# Altium project CSB540otn.PrjPcb (part 2 of 2)

## Sheet cpu_pwr.SchDoc: CPU Power and Bypass
size B; Engineer: Michael J. Kelly; Organization: CSB540otn - Outernet; Address1: AM335x Compute Board; Address2: (C) 2015; Address3: See us on the Web:; Address4: http://outernet.is; DocumentNumber: 8; Revision: V1.0; SheetNumber: 8; SheetTotal: 9
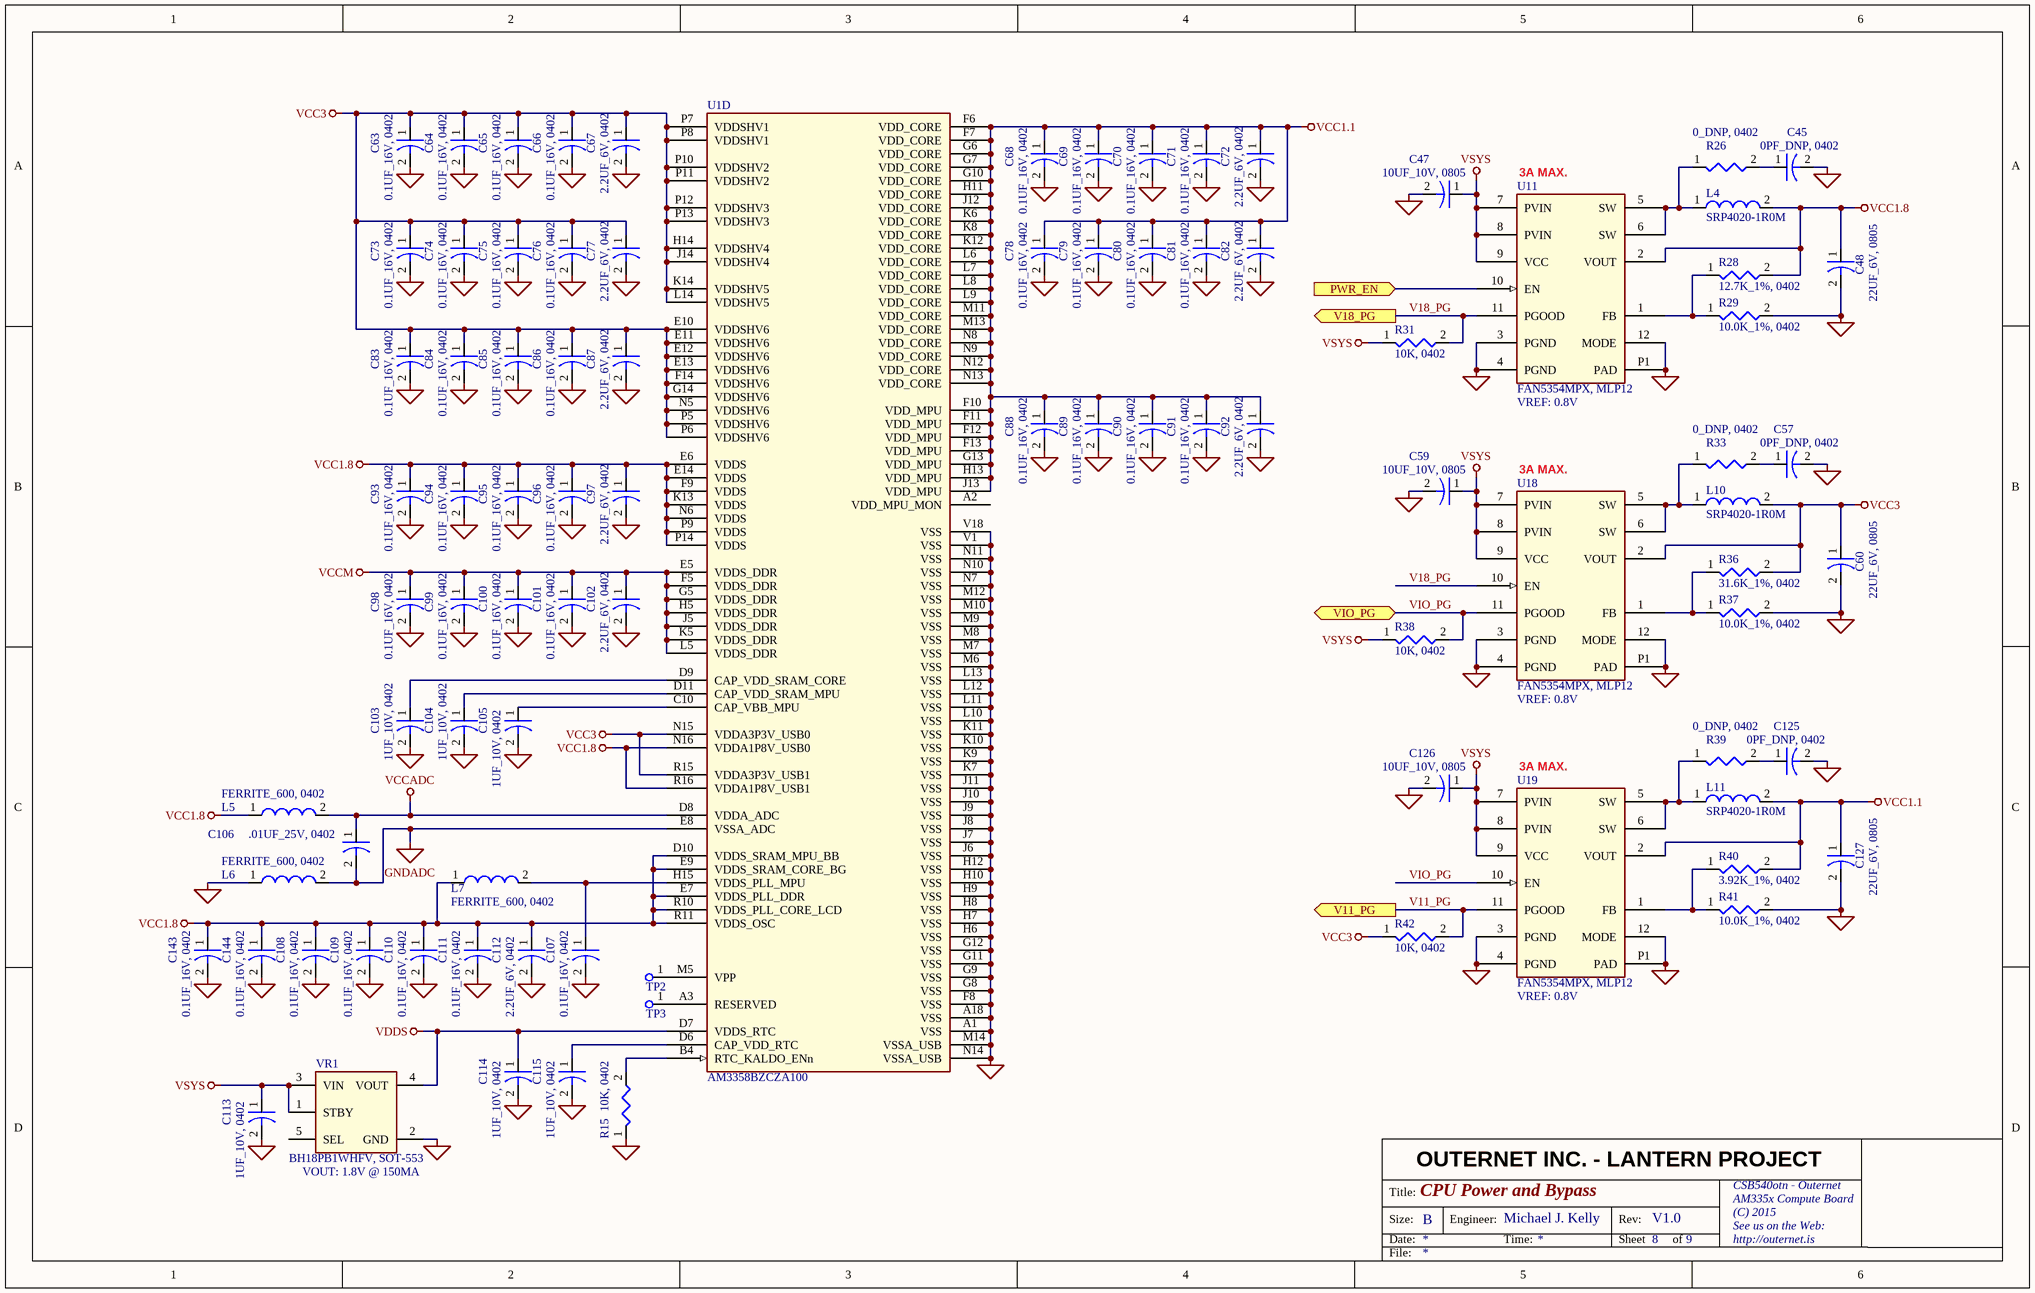
[diagram p6: cpu_pwr.SchDoc]

### Parts
C45  0PF_DNP, 0402  [0402C]
C47  10UF_10V, 0805  [0805C]
C48  22UF_6V, 0805  [0805C]
C57  0PF_DNP, 0402  [0402C]
C59  10UF_10V, 0805  [0805C]
C60  22UF_6V, 0805  [0805C]
C63  0.1UF_16V, 0402  [0402C]
C64  0.1UF_16V, 0402  [0402C]
C65  0.1UF_16V, 0402  [0402C]
C66  0.1UF_16V, 0402  [0402C]
C67  2.2UF_6V, 0402  [0402C]
C68  0.1UF_16V, 0402  [0402C]
C69  0.1UF_16V, 0402  [0402C]
C70  0.1UF_16V, 0402  [0402C]
C71  0.1UF_16V, 0402  [0402C]
C72  2.2UF_6V, 0402  [0402C]
C73  0.1UF_16V, 0402  [0402C]
C74  0.1UF_16V, 0402  [0402C]
C75  0.1UF_16V, 0402  [0402C]
C76  0.1UF_16V, 0402  [0402C]
C77  2.2UF_6V, 0402  [0402C]
C78  0.1UF_16V, 0402  [0402C]
C79  0.1UF_16V, 0402  [0402C]
C80  0.1UF_16V, 0402  [0402C]
C81  0.1UF_16V, 0402  [0402C]
C82  2.2UF_6V, 0402  [0402C]
C83  0.1UF_16V, 0402  [0402C]
C84  0.1UF_16V, 0402  [0402C]
C85  0.1UF_16V, 0402  [0402C]
C86  0.1UF_16V, 0402  [0402C]
C87  2.2UF_6V, 0402  [0402C]
C88  0.1UF_16V, 0402  [0402C]
C89  0.1UF_16V, 0402  [0402C]
C90  0.1UF_16V, 0402  [0402C]
C91  0.1UF_16V, 0402  [0402C]
C92  2.2UF_6V, 0402  [0402C]
C93  0.1UF_16V, 0402  [0402C]
C94  0.1UF_16V, 0402  [0402C]
C95  0.1UF_16V, 0402  [0402C]
C96  0.1UF_16V, 0402  [0402C]
C97  2.2UF_6V, 0402  [0402C]
C98  0.1UF_16V, 0402  [0402C]
C99  0.1UF_16V, 0402  [0402C]
C100  0.1UF_16V, 0402  [0402C]
C101  0.1UF_16V, 0402  [0402C]
C102  2.2UF_6V, 0402  [0402C]
C103  1UF_10V, 0402  [0402C]
C104  1UF_10V, 0402  [0402C]
C105  1UF_10V, 0402  [0402C]
C106  .01UF_25V, 0402  [0402C]
C107  0.1UF_16V, 0402  [0402C]
C108  0.1UF_16V, 0402  [0402C]
C109  0.1UF_16V, 0402  [0402C]
C110  0.1UF_16V, 0402  [0402C]
C111  0.1UF_16V, 0402  [0402C]
C112  2.2UF_6V, 0402  [0402C]
C113  1UF_10V, 0402  [0402C]
C114  1UF_10V, 0402  [0402C]
C115  1UF_10V, 0402  [0402C]
C125  0PF_DNP, 0402  [0402C]
C126  10UF_10V, 0805  [0805C]
C127  22UF_6V, 0805  [0805C]
C143  0.1UF_16V, 0402  [0402C]
C144  0.1UF_16V, 0402  [0402C]
L4  SRP4020-1R0M  [SRP4020]
L5  FERRITE_600, 0402  [0402L]
L6  FERRITE_600, 0402  [0402L]
L7  FERRITE_600, 0402  [0402L]
L10  SRP4020-1R0M  [SRP4020]
L11  SRP4020-1R0M  [SRP4020]
R15  10K, 0402  [0402R]
R26  0_DNP, 0402  [0402R]
R28  12.7K_1%, 0402  [0402R]
R29  10.0K_1%, 0402  [0402R]
R31  10K, 0402  [0402R]
R33  0_DNP, 0402  [0402R]
R36  31.6K_1%, 0402  [0402R]
R37  10.0K_1%, 0402  [0402R]
R38  10K, 0402  [0402R]
R39  0_DNP, 0402  [0402R]
R40  3.92K_1%, 0402  [0402R]
R41  10.0K_1%, 0402  [0402R]
R42  10K, 0402  [0402R]
TP2  TP20R  [TP_20R]  (value not drawn)
TP3  TP20R  [TP_20R]  (value not drawn)
U1  AM3358BZCZA100  [BGA324x18]  (part D of 4)
U11  FAN5354MPX, MLP12  VREF: 0.8V  [mlp12]
U18  FAN5354MPX, MLP12  VREF: 0.8V  [mlp12]
U19  FAN5354MPX, MLP12  VREF: 0.8V  [mlp12]
VR1  BH18PB1WHFV, SOT-553  VOUT: 1.8V @ 150MA  [SOT-553]

### Ports
PWR_EN (in), V11_PG (out), V18_PG (out), VIO_PG (bidir)

### Nets
GND: C45.2 C47.2 C48.2 C57.2 C59.2 C60.2 C63.2 C64.2 C65.2 C66.2 C67.2 C68.2 C69.2 C70.2 C71.2 C72.2 C73.2 C74.2 C75.2 C76.2 C77.2 C78.2 C79.2 C80.2 C81.2 C82.2 C83.2 C84.2 C85.2 C86.2 C87.2 C88.2 C89.2 C90.2 C91.2 C92.2 C93.2 C94.2 C95.2 C96.2 C97.2 C98.2 C99.2 C100.2 C101.2 C102.2 C103.2 C104.2 C105.2 C107.2 C108.2 C109.2 C110.2 C111.2 C112.2 C113.2 C114.2 C115.2 C125.2 C126.2 C127.2 C143.2 C144.2 L6.1 R15.1 R29.2 R37.2 R41.2 U1.A1(VSS) U1.A18(VSS) U1.F8(VSS) U1.G8(VSS) U1.G9(VSS) U1.G11(VSS) U1.G12(VSS) U1.H6(VSS) U1.H7(VSS) U1.H8(VSS) U1.H9(VSS) U1.H10(VSS) U1.H12(VSS) U1.J6(VSS) U1.J7(VSS) U1.J8(VSS) U1.J9(VSS) U1.J10(VSS) U1.J11(VSS) U1.K7(VSS) U1.K9(VSS) U1.K10(VSS) U1.K11(VSS) U1.L10(VSS) U1.L11(VSS) U1.L12(VSS) U1.L13(VSS) U1.M6(VSS) U1.M7(VSS) U1.M8(VSS) U1.M9(VSS) U1.M10(VSS) U1.M12(VSS) U1.M14(VSSA_USB) U1.N7(VSS) U1.N10(VSS) U1.N11(VSS) U1.N14(VSSA_USB) U1.V1(VSS) U1.V18(VSS) U11.3(PGND) U11.4(PGND) U11.12(MODE) U11.P1(PAD) U18.3(PGND) U18.4(PGND) U18.12(MODE) U18.P1(PAD) U19.3(PGND) U19.4(PGND) U19.12(MODE) U19.P1(PAD) VR1.2(GND)
GNDADC: C106.2 L6.2 U1.E8(VSSA_ADC)
VCC1.1: C68.1 C69.1 C70.1 C71.1 C72.1 C78.1 C79.1 C80.1 C81.1 C82.1 C88.1 C89.1 C90.1 C91.1 C92.1 C127.1 L11.2 R40.2 U1.F6(VDD_CORE) U1.F7(VDD_CORE) U1.F10(VDD_MPU) U1.F11(VDD_MPU) U1.F12(VDD_MPU) U1.F13(VDD_MPU) U1.G6(VDD_CORE) U1.G7(VDD_CORE) U1.G10(VDD_CORE) U1.G13(VDD_MPU) U1.H11(VDD_CORE) U1.H13(VDD_MPU) U1.J12(VDD_CORE) U1.J13(VDD_MPU) U1.K6(VDD_CORE) U1.K8(VDD_CORE) U1.K12(VDD_CORE) U1.L6(VDD_CORE) U1.L7(VDD_CORE) U1.L8(VDD_CORE) U1.L9(VDD_CORE) U1.M11(VDD_CORE) U1.M13(VDD_CORE) U1.N8(VDD_CORE) U1.N9(VDD_CORE) U1.N12(VDD_CORE) U1.N13(VDD_CORE) U19.2(VOUT)
VCC1.8: C48.1 C93.1 C94.1 C95.1 C96.1 C97.1 C108.1 C109.1 C110.1 C111.1 C112.1 C143.1 C144.1 L4.2 L5.1 L7.1 R28.2 U1.D10(VDDS_SRAM_MPU_BB) U1.E6(VDDS) U1.E7(VDDS_PLL_DDR) U1.E9(VDDS_SRAM_CORE_BG) U1.E14(VDDS) U1.F9(VDDS) U1.K13(VDDS) U1.N6(VDDS) U1.N16(VDDA1P8V_USB0) U1.P9(VDDS) U1.P14(VDDS) U1.R10(VDDS_PLL_CORE_LCD) U1.R11(VDDS_OSC) U1.R16(VDDA1P8V_USB1) U11.2(VOUT)
VCC3: C60.1 C63.1 C64.1 C65.1 C66.1 C67.1 C73.1 C74.1 C75.1 C76.1 C77.1 C83.1 C84.1 C85.1 C86.1 C87.1 L10.2 R36.2 R42.1 U1.E10(VDDSHV6) U1.E11(VDDSHV6) U1.E12(VDDSHV6) U1.E13(VDDSHV6) U1.F14(VDDSHV6) U1.G14(VDDSHV6) U1.H14(VDDSHV4) U1.J14(VDDSHV4) U1.K14(VDDSHV5) U1.L14(VDDSHV5) U1.N5(VDDSHV6) U1.N15(VDDA3P3V_USB0) U1.P5(VDDSHV6) U1.P6(VDDSHV6) U1.P7(VDDSHV1) U1.P8(VDDSHV1) U1.P10(VDDSHV2) U1.P11(VDDSHV2) U1.P12(VDDSHV3) U1.P13(VDDSHV3) U1.R15(VDDA3P3V_USB1) U18.2(VOUT)
VCCADC: C106.1 L5.2 U1.D8(VDDA_ADC)
VCCM: C98.1 C99.1 C100.1 C101.1 C102.1 U1.E5(VDDS_DDR) U1.F5(VDDS_DDR) U1.G5(VDDS_DDR) U1.H5(VDDS_DDR) U1.J5(VDDS_DDR) U1.K5(VDDS_DDR) U1.L5(VDDS_DDR)
VDDS: C114.1 U1.D7(VDDS_RTC) VR1.4(VOUT)
VSYS: C47.1 C59.1 C113.1 C126.1 R31.1 R38.1 U11.7(PVIN) U11.8(PVIN) U11.9(VCC) U18.7(PVIN) U18.8(PVIN) U18.9(VCC) U19.7(PVIN) U19.8(PVIN) U19.9(VCC) VR1.1(STBY) VR1.3(VIN)
PWR_EN: U11.10(EN) ; port PWR_EN
V11_PG: R42.2 U19.11(PGOOD) ; port V11_PG
V18_PG: R31.2 U11.11(PGOOD) U18.10(EN) ; port V18_PG
VIO_PG: R38.2 U18.11(PGOOD) U19.10(EN) ; port VIO_PG
NetC45_1: C45.1 R26.2
NetC57_1: C57.1 R33.2
NetC103_1: C103.1 U1.D9(CAP_VDD_SRAM_CORE)
NetC104_1: C104.1 U1.D11(CAP_VDD_SRAM_MPU)
NetC105_1: C105.1 U1.C10(CAP_VBB_MPU)
NetC107_1: C107.1 L7.2 U1.H15(VDDS_PLL_MPU)
NetC115_1: C115.1 U1.D6(CAP_VDD_RTC)
NetC125_1: C125.1 R39.2
NetL4_1: L4.1 R26.1 U11.5(SW) U11.6(SW)
NetL10_1: L10.1 R33.1 U18.5(SW) U18.6(SW)
NetL11_1: L11.1 R39.1 U19.5(SW) U19.6(SW)
NetR15_2: R15.2 U1.B4(RTC_KALDO_ENn)
NetR28_1: R28.1 R29.1 U11.1(FB)
NetR36_1: R36.1 R37.1 U18.1(FB)
NetR40_1: R40.1 R41.1 U19.1(FB)
NetTP2_1: TP2.1(TP) U1.M5(VPP)
NetTP3_1: TP3.1(TP) U1.A3(RESERVED)

Not connected (* = marked no-connect by the designer): U1 A2(VDD_MPU_MON); VR1 5(SEL)

### Notes on the sheet
- (near U11) 3A MAX.
- (near U18) 3A MAX.
- (near U19) 3A MAX.
- OUTERNET INC. - LANTERN PROJECT
- Title:
- Size:
- Date:
- B
- Engineer:
- Time:
- Rev:
- Sheet
- of
- File:

### Library data of the parts
C45 C57 C125 = 0PF_DNP, 0402: CAP - 0402 PKG
C47 C59 C126 = 10UF_10V, 0805: CAP - 0805 PKG
C48 C60 C127 = 22UF_6V, 0805: CAP - 0805 PKG
C63-C66 C68-C71 C73-C76 C78-C81 C83-C86 C88-C91 C93-C96 C98-C101 C107-C111 C143 C144 = 0.1UF_16V, 0402: CAP - 0402 PKG
C67 C72 C77 C82 C87 C92 C97 C102 C112 = 2.2UF_6V, 0402: CAP - 0402 PKG
C103-C105 C113-C115 = 1UF_10V, 0402: CAP - 0402 PKG
C106 = .01UF_25V, 0402: CAP - 0402 PKG
L4 L10 L11 = SRP4020-1R0M: INDUCTOR - 1.0UH, 5/6A, 4MM x 4MM x 2MM, 22mohm
L5-L7 = FERRITE_600, 0402: FERRITE BEAD - 600 OHM, 300MA, 0402 PKG
R15 R31 R38 R42 = 10K, 0402: RES - 0402 PKG
R26 R33 R39 = 0_DNP, 0402: RES - 0402 PKG, DO NOT POPULATE BY DEFAULT
R28 = 12.7K_1%, 0402: RES - 0402 PKG
R29 R37 R41 = 10.0K_1%, 0402: RES - 0402 PKG
R36 = 31.6K_1%, 0402: RES - 0402 PKG
R40 = 3.92K_1%, 0402: RES - 0402 PKG
TP2 TP3 = TP20R: MISC - TEST PAD, 20MIL ROUND
U1 = AM3358BZCZA100: MPU - CORTEX-A8 CORE, SDIO, GIGe, USB x2, UART x3, CAN, 2D/3D
U11 U18 U19 = FAN5354MPX, MLP12: SWITCHER - 270ua Iq, 3A, 2.7V TO 5.5V IN, 0.8V TO VIN OUT
VR1 = BH18PB1WHFV, SOT-553: LDO - 4ua Iq, 150ma, 3.4V - 5.5V IN, 1.8V OUT, 600mv Vdrop

## Sheet bat_ctl.SchDoc: USB Battery Charger w/Solar In
size B; Engineer: Michael J. Kelly; Organization: CSB540otn - Outernet; Address1: AM335x Compute Board; Address2: (C) 2015; Address3: See us on the Web:; Address4: http://outernet.is; DocumentNumber: 9; Revision: V1.0; SheetNumber: 9; SheetTotal: 9
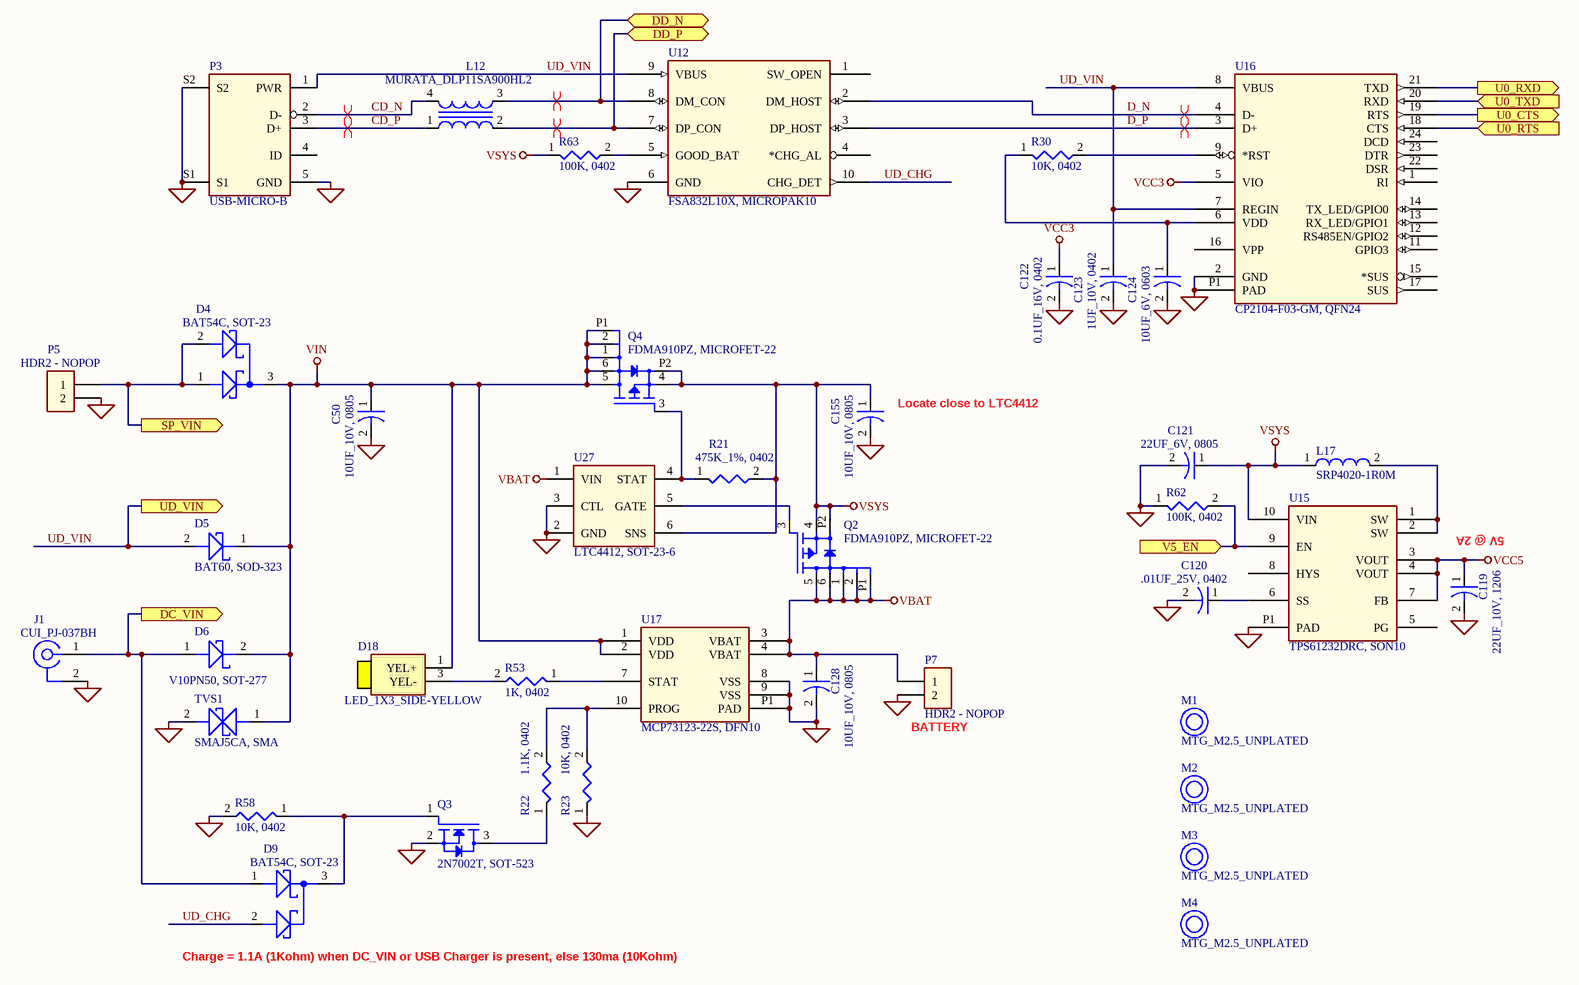
[diagram p7: bat_ctl.SchDoc]

### Parts
C50  10UF_10V, 0805  [0805C]
C119  22UF_10V, 1206  [1206C]
C120  .01UF_25V, 0402  [0402C]
C121  22UF_6V, 0805  [0805C]
C122  0.1UF_16V, 0402  [0402C]
C123  1UF_10V, 0402  [0402C]
C124  10UF_6V, 0603  [0603C]
C128  10UF_10V, 0805  [0805C]
C155  10UF_10V, 0805  [0805C]
D4  BAT54C, SOT-23  [SOT-23]
D5  BAT60, SOD-323  [SOD-323]
D6  V10PN50, SOT-277  [SOT-277]
D9  BAT54C, SOT-23  [SOT-23]
D18  LED_1X3_SIDE-YELLOW  [LED_1X3_SIDE-YELLOW]
J1  CUI_PJ-037BH  [CUI_PJ-037B]
L12  MURATA_DLP11SA900HL2  [PANASONIC_EXC24C]
L17  SRP4020-1R0M  [SRP4020]
M1  MTG_M2.5_UNPLATED  [MTG_M2.5_UNPLATED]
M2  MTG_M2.5_UNPLATED  [MTG_M2.5_UNPLATED]
M3  MTG_M2.5_UNPLATED  [MTG_M2.5_UNPLATED]
M4  MTG_M2.5_UNPLATED  [MTG_M2.5_UNPLATED]
P3  USB-MICRO-B  [USB-MICRO-B]
P5  HDR2 - NOPOP  [HDR2X1-NOPOP]
P7  HDR2 - NOPOP  [HDR2X1-NOPOP]
Q2  FDMA910PZ, MICROFET-22  [MICROFET-22]
Q3  2N7002T, SOT-523  [SOT-523]
Q4  FDMA910PZ, MICROFET-22  [MICROFET-22]
R21  475K_1%, 0402  [0402R]
R22  1.1K, 0402  [0402R]
R23  10K, 0402  [0402R]
R30  10K, 0402  [0402R]
R53  1K, 0402  [0402R]
R58  10K, 0402  [0402R]
R62  100K, 0402  [0402R]
R63  100K, 0402  [0402R]
TVS1  SMAJ5CA, SMA  [SMA]
U12  FSA832L10X, MICROPAK10  [MICROpack10]
U15  TPS61232DRC, SON10  [SON10]
U16  CP2104-F03-GM, QFN24  [QFN24]
U17  MCP73123-22S, DFN10  [DFN10]
U27  LTC4412, SOT-23-6  [SOT-23-6]

### Ports
DC_VIN (out), DD_N (bidir), DD_P (bidir), SP_VIN (out), U0_CTS (out), U0_RTS (in), U0_RXD (out), U0_TXD (in), UD_VIN (out), V5_EN (in)

### Nets
GND: C50.2 C119.2 C120.2 C121.2 C122.2 C123.2 C124.2 C128.2 C155.2 J1.2 P3.5(GND) P3.S1 P3.S2 P5.2 P7.2 Q3.2(SOURCE) R23.1 R58.2 R62.1 TVS1.2 U12.6(GND) U15.P1(PAD) U16.2(GND) U16.P1(PAD) U17.8(VSS) U17.9(VSS) U17.P1(PAD) U27.2(GND) U27.3(CTL)
VBAT: C128.1 P7.1 Q2.1 Q2.2 Q2.5(D1) Q2.6(D2) Q2.P1(D5) U17.3(VBAT) U17.4(VBAT) U27.1(VIN)
VCC3: C122.1 U16.5(VIO)
VCC5: C119.1 U15.3(VOUT) U15.4(VOUT) U15.7(FB)
VIN: C50.1 D4.3 D5.1(CATHODE) D6.2(CATHODE) D18.1(YEL+) Q4.1 Q4.2 Q4.5(D1) Q4.6(D2) Q4.P1(D5) TVS1.1 U17.1(VDD) U17.2(VDD)
VSYS: C121.1 C155.1 L17.1 Q2.4 Q2.P2 Q4.4 Q4.P2 R21.2 R63.1 U15.10(VIN) U27.6(SNS)
CD_N: L12.4 P3.2(D-)  [project net CD_N_9]
CD_P: L12.1 P3.3(D+)  [project net CD_P_9]
CFG11: R62.2 U15.9(EN) ; port V5_EN
D_N: U12.2(DM_HOST) U16.4(D-)  [project net D_N_9]
D_P: U12.3(DP_HOST) U16.3(D+)  [project net D_P_9]
DC_VIN: D6.1(ANODE) D9.1 J1.1 ; port DC_VIN
DD_N: L12.3 U12.8(DM_CON) ; port DD_N
DD_P: L12.2 U12.7(DP_CON) ; port DD_P
SP_VIN: D4.1 D4.2 P5.1 ; port SP_VIN
U0_CTS: U16.19(RTS) ; port U0_CTS
U0_RTS: U16.18(CTS) ; port U0_RTS
U0_RXD: U16.21(TXD) ; port U0_RXD
U0_TXD: U16.20(RXD) ; port U0_TXD
UD_CHG: D9.2 U12.10(CHG_DET)  [project net UD_CHG_9]
UD_VIN: C123.1 D5.2(ANODE) P3.1(PWR) U12.9(VBUS) U16.7(REGIN) U16.8(VBUS) ; port UD_VIN
NetC120_1: C120.1 U15.6(SS)
NetC124_1: C124.1 R30.1 U16.6(VDD)
NetD9_3: D9.3 Q3.1(GATE) R58.1
NetD18_3: D18.3(YEL-) R53.2
NetL17_2: L17.2 U15.1(SW) U15.2(SW)
NetQ2_3: Q2.3 U27.5(GATE)
NetQ3_3: Q3.3(DRAIN) R22.1
NetQ4_3: Q4.3 R21.1 U27.4(STAT)
NetR22_2: R22.2 R23.2 U17.10(PROG)
NetR30_2: R30.2 U16.9(*RST)
NetR53_1: R53.1 U17.7(STAT)
NetR63_2: R63.2 U12.5(GOOD_BAT)

Not connected (* = marked no-connect by the designer): P3 4(ID); U12 1(SW_OPEN) 4(*CHG_AL); U15 5(PG) 8(HYS); U16 1(RI) 11(GPIO3) 12(RS485EN/GPIO2) 13(RX_LED/GPIO1) 14(TX_LED/GPIO0) 15(*SUS) 16(VPP) 17(SUS) 22(DSR) 23(DTR) 24(DCD)

### Layout directives
differential pair: CD_N_9, CD_P_9, D_N_9, D_P_9, DD_N, DD_P

### Notes on the sheet
- (near C155) Locate close to LTC4412
- (near C119) 5V @ 2A
- (near P7) BATTERY
- (near D9) Charge = 1.1A (1Kohm) when DC_VIN or USB Charger is present, else 130ma (10Kohm)
- OUTERNET INC. - LANTERN PROJECT
- Title:
- Size:
- Date:
- B
- Engineer:
- Time:
- Rev:
- Sheet
- of
- File:

### Library data of the parts
C50 C128 C155 = 10UF_10V, 0805: CAP - 0805 PKG
C119 = 22UF_10V, 1206: CAP - 1206 PKG
C120 = .01UF_25V, 0402: CAP - 0402 PKG
C121 = 22UF_6V, 0805: CAP - 0805 PKG
C122 = 0.1UF_16V, 0402: CAP - 0402 PKG
C123 = 1UF_10V, 0402: CAP - 0402 PKG
C124 = 10UF_6V, 0603: CAP - 0603 PKG
D4 D9 = BAT54C, SOT-23: DIODE - DUAL SCHOTTKY, COMMON CATHODE, 30V, 200MA
D5 = BAT60, SOD-323: DIODE - POWER, SCHOTTKY, 10V, 3A
D6 = V10PN50, SOT-277: DIODE - SCHOTTKY, 50V, 10A
D18 = LED_1X3_SIDE-YELLOW: LED - SIDEVIEW, SMT, YELLOW
J1 = CUI_PJ-037BH: CONN - DC JACK, 2.5mm CENTER PLUS, 5 AMP
L12 = MURATA_DLP11SA900HL2: FERRITE - COMMON MODE FILTER, USB2/HDMI/GIGe, FILM
L17 = SRP4020-1R0M: as L4 on sheet cpu_pwr
M1-M4 = MTG_M2.5_UNPLATED: MTG HOLE - 2.75mm HOLE 2-56 OR M2.5
P3 = USB-MICRO-B: CONN - USB TYPE B MICRO
P5 P7 = HDR2 - NOPOP: HEADER - 2-PIN, HOLES ONLY FOR WIRE
Q2 Q4 = FDMA910PZ, MICROFET-22: P-FET - 20V, 7.2A @ 1.8Vgs, 34mohm
Q3 = 2N7002T, SOT-523: N-FET - 60V, 500ma @ 10V, Vgs(th) 2V
R21 = 475K_1%, 0402: RES - 0402 PKG
R22 = 1.1K, 0402: RES - 0402 PKG
R23 R30 R58 = 10K, 0402: RES - 0402 PKG
R53 = 1K, 0402: RES - 0402 PKG
R62 R63 = 100K, 0402: RES - 0402 PKG
TVS1 = SMAJ5CA, SMA: DIODE - TVS, 6.4V MIN., 7.25V MAX.
U12 = FSA832L10X, MICROPAK10: USB - BATTERY CHARGER DETECTION W/SWITCH
U15 = TPS61232DRC, SON10: SWITCHER - 500ua Iq, BOOST 5A, 2.3V TO 5.5V IN, 2.5V TO 5.5V OUT
U16 = CP2104-F03-GM, QFN24: USB - UART W/4 GPIO
U17 = MCP73123-22S, DFN10: IC - BATTERY CHARGER, 1 CELL LiFePO4, 1.1 AMAX
U27 = LTC4412, SOT-23-6: IC - POWER SOURCE SELECTOR

## Nets that join several sheets
GND: ddr3_if (62 pins), cpu_nand (43 pins), cpu_io (17 pins), enet_phy (13 pins), rf_mods (25 pins), io_conn (47 pins), cpu_pwr (121 pins), bat_ctl (29 pins)
GNDADC: cpu_io (5 pins), cpu_pwr (C106.2 L6.2 U1.E8)
VBAT: cpu_io (RN3.8 RN4.5), bat_ctl (10 pins)
VCC3: ddr3_if (C28.1 U7.7 U7.10), cpu_nand (35 pins), cpu_io (R1.2 RN1.6 RN9.6), enet_phy (8 pins), rf_mods (U22.4 U24#2.4), io_conn (35 pins), cpu_pwr (41 pins), bat_ctl (C122.1 U16.5)
VCC5: cpu_io (U24#1.4), io_conn (6 pins), bat_ctl (C119.1 U15.3 U15.4 U15.7)
VCCADC: cpu_io (U1.B9), cpu_pwr (C106.1 L5.2 U1.D8)
VCCM: ddr3_if (41 pins), cpu_pwr (12 pins)
VDDS: cpu_nand (5 pins), cpu_pwr (C114.1 U1.D7 VR1.4)
VSYS: ddr3_if (C132.1 U20.7 U20.8 U20.9), rf_mods (C134.1 L22.1 U28.4 U28.5), cpu_pwr (17 pins), bat_ctl (11 pins)
*PHY_RST: cpu_nand (U1.V17), enet_phy (U8.15)
*SD_CD: cpu_nand (U1.A15), io_conn (RN13.2 SD1.9)
*STG_LED: cpu_nand (U1.V6), io_conn (D11.3)
*USB_PE0: cpu_io (U1.D12), io_conn (U21.4)
*USB_PE1: cpu_io (U1.C12), io_conn (U3.4)
*USB_PE2: cpu_io (U1.V5), io_conn (U26.4)
*WI_LED0: cpu_io (U1.A14), io_conn (D3.3)
*WI_LED1: cpu_io (U1.A13), io_conn (D7.3)
*WI_LED2: cpu_io (U1.B13), io_conn (D8.3)
CFG0: cpu_io (RN1.1 U1.R1), rf_mods (U13.9)
CFG1: cpu_io (RN1.2 U1.R2), rf_mods (U13.20)
CFG2: cpu_io (RN1.3 U1.R3), rf_mods (U13.8)
CFG3: cpu_io (RN1.4 U1.R4), rf_mods (U13.19)
CFG4: cpu_io (RN9.1 U1.T1), rf_mods (U13.7)
CFG5: cpu_io (RN9.2 U1.T2), rf_mods (U13.18)
CFG6: cpu_io (RN10.1 U1.T3), rf_mods (U13.6)
CFG7: cpu_io (RN10.2 U1.T4), rf_mods (U13.17)
CFG11: cpu_io (RN11.2 U1.U4), bat_ctl (R62.2 U15.9)
CFG12: cpu_io (RN11.3 U1.V2), rf_mods (U24#2.3)
CFG13: cpu_io (RN11.4 U1.V3), rf_mods (U22.3)
DC_VIN: cpu_io (RN3.5 RN4.8), bat_ctl (D6.1 D9.1 J1.1)
DD_N: io_conn (D10.1), bat_ctl (L12.3 U12.8)
DD_P: io_conn (D10.2), bat_ctl (L12.2 U12.7)
E1_CRS: cpu_io (U1.H17), enet_phy (U8.11)
E1_LNK: enet_phy (U8.3), io_conn (P1.12)
E1_RD_N: enet_phy (U8.22), io_conn (P1.2)
E1_RD_P: enet_phy (U8.23), io_conn (P1.1)
E1_REFCLK: cpu_io (U1.H18), enet_phy (R50.2)
E1_RXD0: cpu_io (U1.M16), enet_phy (U8.8)
E1_RXD1: cpu_io (U1.L15), enet_phy (U8.7)
E1_RXER: cpu_io (U1.J15), enet_phy (R54.2 U8.10)
E1_TD_N: enet_phy (U8.20), io_conn (P1.4)
E1_TD_P: enet_phy (U8.21), io_conn (P1.5)
E1_TXD0: cpu_io (U1.K17), enet_phy (U8.17)
E1_TXD1: cpu_io (U1.K16), enet_phy (U8.18)
E1_TXEN: cpu_io (U1.J16), enet_phy (U8.16)
I2C0_SCL: cpu_io (U1.C16), rf_mods (Q6.6)
I2C0_SDA: cpu_io (U1.C17), rf_mods (Q6.3)
LNB_VSEL: cpu_io (U1.D18), rf_mods (Q5.1)
MDC: cpu_io (U1.M18), enet_phy (U8.13)
MDIO: cpu_io (U1.M17), enet_phy (R2.1 U8.12)
PWR_EN: cpu_nand (U1.C6), cpu_pwr (U11.10)
REF_SEL: enet_phy (R52.2 U8.2), io_conn (P1.14)
SD_CLK: cpu_nand (U1.G17), io_conn (RN12.2 SD1.5)
SD_CMD: cpu_nand (U1.G18), io_conn (RN12.1 SD1.3)
SD_D0: cpu_nand (U1.G16), io_conn (RN12.3 SD1.7)
SD_D1: cpu_nand (U1.G15), io_conn (RN12.4 SD1.8)
SD_D2: cpu_nand (U1.F18), io_conn (RN13.3 SD1.1)
SD_D3: cpu_nand (U1.F17), io_conn (RN13.4 SD1.2)
SD_WP: cpu_nand (U1.D14), io_conn (RN13.1)
SP_VIN: cpu_io (RN3.7 RN4.6), bat_ctl (D4.1 D4.2 P5.1)
TS1_CLK: cpu_io (U1.D16), rf_mods (U13.21)
TS1_ERR: cpu_io (U1.R5), rf_mods (U13.11)
TS1_SOP: cpu_io (U1.R6), rf_mods (U13.22)
TS1_VAL: cpu_io (U1.U5), rf_mods (U13.10)
U0_CTS: cpu_io (U1.E18), bat_ctl (U16.19)
U0_RTS: cpu_io (U1.E17), bat_ctl (U16.18)
U0_RXD: cpu_io (U1.E15), bat_ctl (U16.21)
U0_TXD: cpu_io (U1.E16), bat_ctl (U16.20)
UD_VIN: cpu_io (RN3.6 RN4.7), bat_ctl (6 pins)
UH2_N: rf_mods (U23.3), io_conn (U25.1)
UH2_P: rf_mods (U23.4), io_conn (U25.2)
USB0_N: cpu_io (U1.N18), io_conn (U25.30)
USB0_P: cpu_io (U1.N17), io_conn (U25.31)
V11_PG: cpu_nand (C156.1 D21.3 U1.B15), cpu_pwr (R42.2 U19.11)
V18_PG: ddr3_if (U20.10), cpu_pwr (R31.2 U11.11 U18.10)
VIO_PG: ddr3_if (U20.11), cpu_pwr (R38.2 U18.11 U19.10)